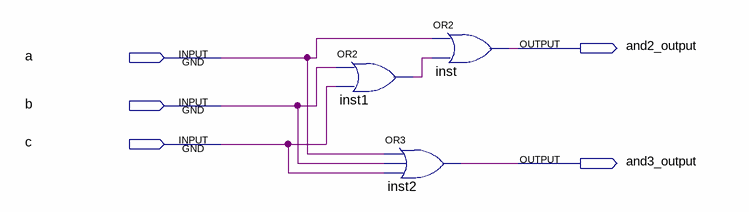
[diagram p0: schematic sheet]
// Quartus schematic 1-1-2.bdf as structural Verilog: 3 symbols, 5 pins
module \1-1-2  (
  input  a,
  input  b,
  input  c,
  output and2_output,
  output and3_output
);

  wire inst1_out;

  or inst1 (inst1_out, b, c);
  or inst2 (and3_output, a, b, c);
  or inst (and2_output, a, inst1_out);
endmodule
